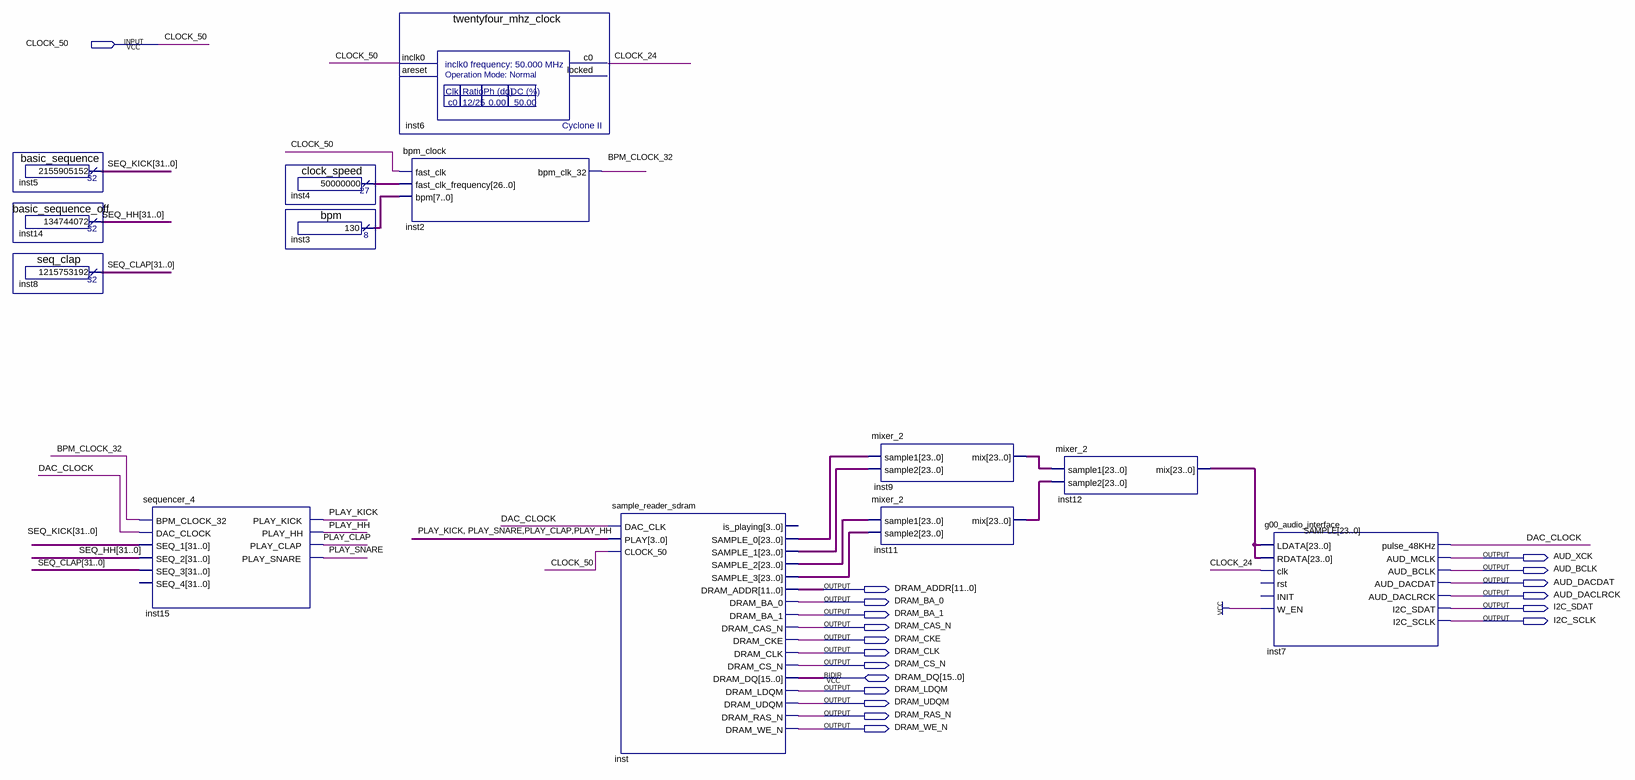
[diagram p0: schematic sheet]
// Quartus schematic main_sdram.bdf as structural Verilog: 13 symbols, 19 pins
module main_sdram (
  input  CLOCK_50,
  inout  [15:0] DRAM_DQ,
  output AUD_XCK,
  output AUD_BCLK,
  output AUD_DACDAT,
  output [11:0] DRAM_ADDR,
  output AUD_DACLRCK,
  output DRAM_BA_0,
  output I2C_SDAT,
  output DRAM_BA_1,
  output I2C_SCLK,
  output DRAM_CAS_N,
  output DRAM_CKE,
  output DRAM_CLK,
  output DRAM_CS_N,
  output DRAM_LDQM,
  output DRAM_UDQM,
  output DRAM_RAS_N,
  output DRAM_WE_N
);

  wire BPM_CLOCK_32, CLOCK_24, DAC_CLOCK, PLAY_CLAP, PLAY_HH, PLAY_KICK, PLAY_SNARE;
  wire [7:0] inst3_result;
  wire [23:0] inst9_mix, inst11_mix, inst_sample_0, inst_sample_1, inst_sample_2, inst_sample_3, SAMPLE;
  wire [26:0] inst4_result;
  wire [31:0] SEQ_CLAP, SEQ_HH, SEQ_KICK;

  basic_sequence inst5 (.result(SEQ_KICK));
  basic_sequence_off inst14 (.result(SEQ_HH));
  seq_clap inst8 (.result(SEQ_CLAP));
  sequencer_4 inst15 (
    .BPM_CLOCK_32(BPM_CLOCK_32), .DAC_CLOCK(DAC_CLOCK), .SEQ_1(SEQ_KICK), .SEQ_2(SEQ_HH), .SEQ_3(SEQ_CLAP),
    .PLAY_KICK(PLAY_KICK), .PLAY_HH(PLAY_HH), .PLAY_CLAP(PLAY_CLAP), .PLAY_SNARE(PLAY_SNARE));  // open: SEQ_4
  clock_speed inst4 (.result(inst4_result));
  bpm inst3 (.result(inst3_result));
  twentyfour_mhz_clock inst6 (.inclk0(CLOCK_50), .c0(CLOCK_24));  // open: areset, locked
  bpm_clock inst2 (
    .fast_clk(CLOCK_50), .fast_clk_frequency(inst4_result), .bpm(inst3_result), .bpm_clk_32(BPM_CLOCK_32));
  sample_reader_sdram inst (
    .DAC_CLK(DAC_CLOCK), .PLAY({PLAY_KICK, PLAY_SNARE, PLAY_CLAP, PLAY_HH}), .CLOCK_50(CLOCK_50),
    .SAMPLE_0(inst_sample_0), .SAMPLE_1(inst_sample_1), .SAMPLE_2(inst_sample_2), .SAMPLE_3(inst_sample_3),
    .DRAM_ADDR(DRAM_ADDR), .DRAM_BA_0(DRAM_BA_0), .DRAM_BA_1(DRAM_BA_1), .DRAM_CAS_N(DRAM_CAS_N),
    .DRAM_CKE(DRAM_CKE), .DRAM_CLK(DRAM_CLK), .DRAM_CS_N(DRAM_CS_N), .DRAM_LDQM(DRAM_LDQM),
    .DRAM_UDQM(DRAM_UDQM), .DRAM_RAS_N(DRAM_RAS_N), .DRAM_WE_N(DRAM_WE_N), .DRAM_DQ(DRAM_DQ));  // open: is_playing
  mixer_2 inst9 (.sample1(inst_sample_0), .sample2(inst_sample_1), .mix(inst9_mix));
  mixer_2 inst11 (.sample1(inst_sample_2), .sample2(inst_sample_3), .mix(inst11_mix));
  mixer_2 inst12 (.sample1(inst9_mix), .sample2(inst11_mix), .mix(SAMPLE));
  g00_audio_interface inst7 (
    .LDATA(SAMPLE), .RDATA(SAMPLE), .clk(CLOCK_24), .W_EN(1'b1), .pulse_48KHz(DAC_CLOCK), .AUD_MCLK(AUD_XCK),
    .AUD_BCLK(AUD_BCLK), .AUD_DACDAT(AUD_DACDAT), .AUD_DACLRCK(AUD_DACLRCK), .I2C_SDAT(I2C_SDAT),
    .I2C_SCLK(I2C_SCLK));  // open: rst, INIT
endmodule
